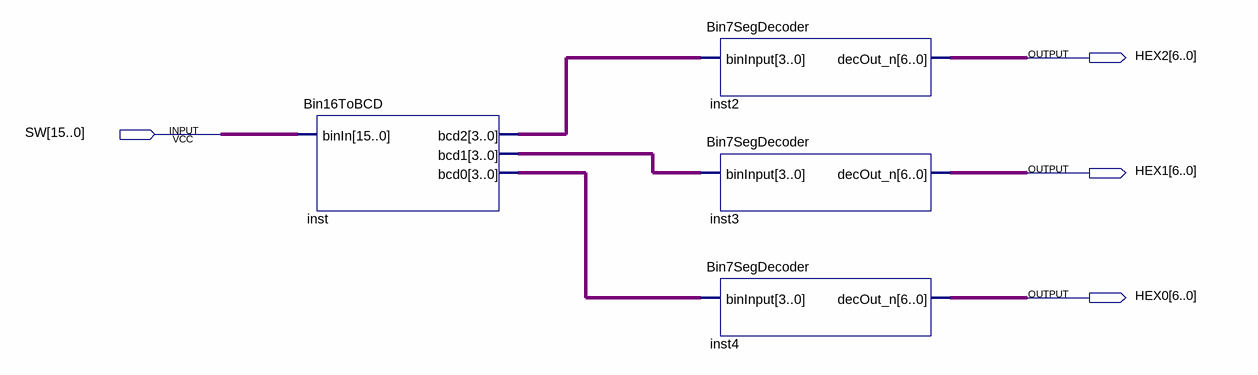
[diagram p0: schematic sheet]
// Quartus schematic Teste.bdf as structural Verilog: 4 symbols, 4 pins
module Teste (
  input  [15:0] SW,
  output [6:0] HEX2,
  output [6:0] HEX1,
  output [6:0] HEX0
);

  wire [3:0] inst_bcd0, inst_bcd1, inst_bcd2;

  Bin16ToBCD inst (.binIn(SW), .bcd2(inst_bcd2), .bcd1(inst_bcd1), .bcd0(inst_bcd0));
  Bin7SegDecoder inst2 (.binInput(inst_bcd2), .decOut_n(HEX2));
  Bin7SegDecoder inst3 (.binInput(inst_bcd1), .decOut_n(HEX1));
  Bin7SegDecoder inst4 (.binInput(inst_bcd0), .decOut_n(HEX0));
endmodule
